# Altium schematic sheet Power.SchDoc
size A4
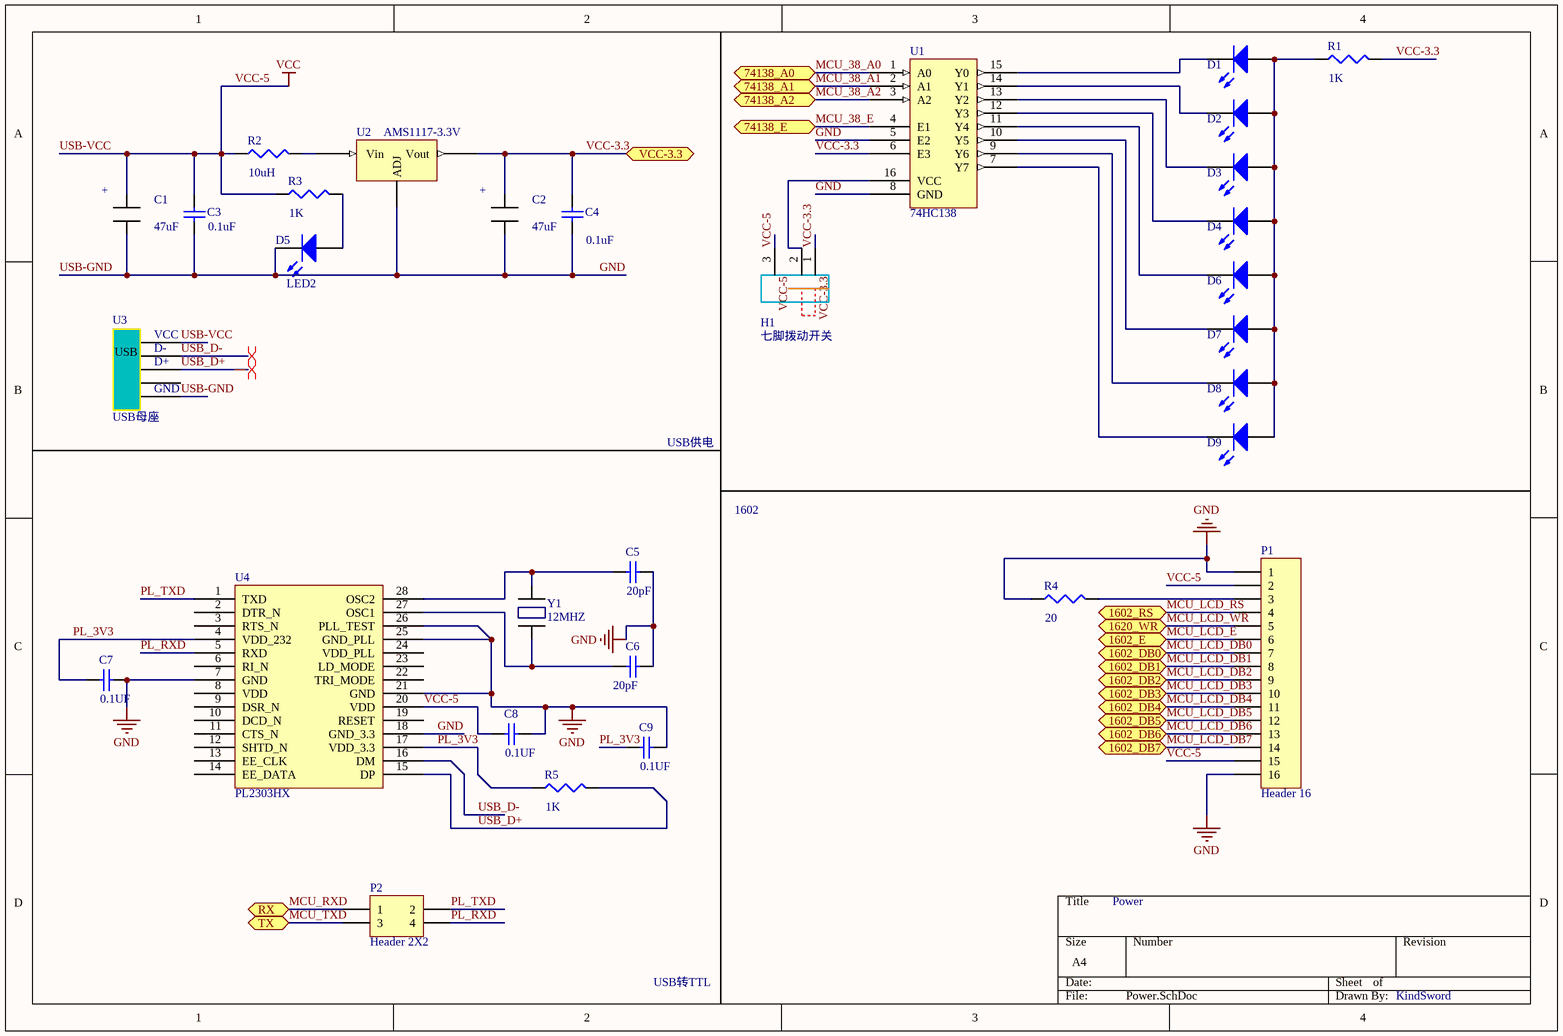
[diagram p0: Power.SchDoc]

## Parts
C1  47uF  [A型坦电容]
C2  47uF  [A型坦电容]
C3  value 0.1uF  [C1206]  (hidden comment: Cap Semi)
C4  value 0.1uF  [C1206]  (hidden comment: Cap Semi)
C5  value 20pF  [C1206]  (hidden comment: Cap Semi)
C6  value 20pF  [C1206]  (hidden comment: Cap Semi)
C7  value 0.1UF  [C1206]  (hidden comment: Cap Semi)
C8  value 0.1UF  [C1206]  (hidden comment: Cap Semi)
C9  value 0.1UF  [C1206]  (hidden comment: Cap Semi)
D1  LED2  [3.2X1.6X1.1]  (value not drawn)
D2  LED2  [3.2X1.6X1.1]  (value not drawn)
D3  LED2  [3.2X1.6X1.1]  (value not drawn)
D4  LED2  [3.2X1.6X1.1]  (value not drawn)
D5  LED2  [3.2X1.6X1.1]
D6  LED1  [3.2X1.6X1.1]  (value not drawn)
D7  LED2  [3.2X1.6X1.1]  (value not drawn)
D8  LED2  [3.2X1.6X1.1]  (value not drawn)
D9  LED2  [3.2X1.6X1.1]  (value not drawn)
H1  七脚拨动开关  [七脚拨动开关]
P1  Header 16  [HDR1X16]
P2  Header 2X2  [HDR2X2]
R1  value 1K  [14-1210]  (hidden comment: Res3)
R2  value 10uH  [14-1210]  (hidden comment: Res3)
R3  value 1K  [14-1210]  (hidden comment: Res3)
R4  value 20  [14-1210]  (hidden comment: Res3)
R5  value 1K  [14-1210]  (hidden comment: Res3)
U1  74HC138  [74HC138]
U2  AMS1117-3.3V  [AMS1117]
U3  USB母座  [MicroUSB母座]
U4  PL2303HX  [PL2303HX]
Y1  12MHZ  [晶振]

## Ports
1602_DB0, 1602_DB1, 1602_DB2, 1602_DB3, 1602_DB4, 1602_DB5, 1602_DB6, 1602_DB7, 1602_E, 1602_RS, 1620_WR, 74138_A0, 74138_A1, 74138_A2, 74138_E, RX, TX, VCC-3.3

## Nets
GND: C1.1(-) C2.1(-) C3.1 C4.1 C5.2 C6.2 C7.2 C8.2 C9.2 D5.2(K) P1.1 P1.16 R4.1 U1.5(E2) U1.8(GND) U2.1(ADJ) U3.5 U4.7(GND) U4.18(GND_3.3) U4.21(GND) U4.25(GND_PLL) U4.26(PLL_TEST)  [also labelled USB-GND]
USB-VCC: C1.2(+) C3.2 C8.1 H1.3 P1.2 P1.15 R2.1 R3.1 U3.1 U4.20(VDD)  [also labelled VCC, VCC-5]
MCU_38_A0: U1.1(A0) ; port 74138_A0
MCU_38_A1: U1.2(A1) ; port 74138_A1
MCU_38_A2: U1.3(A2) ; port 74138_A2
MCU_38_E: U1.4(E1) ; port 74138_E
MCU_LCD_DB0: P1.7 ; port 1602_DB0
MCU_LCD_DB1: P1.8 ; port 1602_DB1
MCU_LCD_DB2: P1.9 ; port 1602_DB2
MCU_LCD_DB3: P1.10 ; port 1602_DB3
MCU_LCD_DB4: P1.11 ; port 1602_DB4
MCU_LCD_DB5: P1.12 ; port 1602_DB5
MCU_LCD_DB6: P1.13 ; port 1602_DB6
MCU_LCD_DB7: P1.14 ; port 1602_DB7
MCU_LCD_E: P1.6 ; port 1602_E
MCU_LCD_RS: P1.4 ; port 1602_RS
MCU_LCD_WR: P1.5 ; port 1620_WR
MCU_RXD: P2.1 ; port RX
MCU_TXD: P2.3 ; port TX
PL_3V3: C7.1 C9.1 R5.1 U4.4(VDD_232) U4.17(VDD_3.3)
PL_RXD: P2.4 U4.5(RXD)
PL_TXD: P2.2 U4.1(TXD)
USB_D+: R5.2 U3.3 U4.15(DP)
USB_D-: U3.2 U4.16(DM)
VCC-3.3: C2.2(+) C4.2 H1.1 R1.2 U1.6(E3) U2.2(Vout) ; port VCC-3.3
NetC5_1: C5.1 U4.28(OSC2) Y1.2
NetC6_1: C6.1 U4.27(OSC1) Y1.1
NetD1_1: D1.1(A) D2.1(A) D3.1(A) D4.1(A) D6.1(A) D7.1(A) D8.1(A) D9.1(A) R1.1
NetD1_2: D1.2(K) U1.15(Y0)
NetD2_2: D2.2(K) U1.14(Y1)
NetD3_2: D3.2(K) U1.13(Y2)
NetD4_2: D4.2(K) U1.12(Y3)
NetD5_1: D5.1(A) R3.2
NetD6_2: D6.2(K) U1.11(Y4)
NetD7_2: D7.2(K) U1.10(Y5)
NetD8_2: D8.2(K) U1.9(Y6)
NetD9_2: D9.2(K) U1.7(Y7)
NetH1_2: H1.2 U1.16(VCC)
NetP1_3: P1.3 R4.2
NetR2_2: R2.2 U2.3(Vin)

Not connected (* = marked no-connect by the designer): U3 4; U4 2(DTR_N) 3(RTS_N) 6(RI_N) 8(VDD) 9(DSR_N) 10(DCD_N) 11(CTS_N) 12(SHTD_N) 13(EE_CLK) 14(EE_DATA) 19(RESET) 22(TRI_MODE) 23(LD_MODE) 24(VDD_PLL)

## Layout directives
differential pair: USB_D+, USB_D-

## Notes on the sheet
- USB供电
- 1602
- Power
- USB转TTL
- KindSword
- Labels drawn without touching a wire or pin: VCC-3.3, VCC-5
- (in symbol MicroUSB母座) VCC; D-; D+; GND; / USB /

## Library data of the parts
C1 C2 = A型坦电容: pin to pad: 1>0 2>1
C3-C9 = Cap Semi: Capacitor (Semiconductor SIM Model); Published: 8-Jun-2000; LatestRevisionDate: 29-May-2009; LatestRevisionNote: IPC-7351 Footprint Added.; PackageReference: C1206; Publisher: Altium Limited; PackageDescription: Chip Capacitor
D1-D9 = LED2: Typical RED, GREEN, YELLOW, AMBER GaAs LED; Published: 8-Jun-2000; LatestRevisionDate: 17-Jul-2002; LatestRevisionNote: Re-released for DXP Platform.; PackageVersion: Feb-2002; PackageReference: 3.2X1.6X1.1; Publisher: Altium Limited; PackageDescription: SM LED; 2 Flat Leads
H1 = 七脚拨动开关: H?
P1 = Header 16: Header, 16-Pin; LatestRevisionDate: 17-Jul-2002; LatestRevisionNote: Re-released for DXP Platform.; Publisher: Altium Limited
P2 = Header 2X2: Header, 2-Pin, Dual row; LatestRevisionDate: 17-Jul-2002; LatestRevisionNote: Re-released for DXP Platform.; Publisher: Altium Limited
R1-R5 = Res3: Resistor; Published: 8-Jun-2000; LatestRevisionDate: 29-May-2009; LatestRevisionNote: IPC-7351 Footprint Added.; PackageReference: J1-0603; Publisher: Altium Limited; PackageDescription: Chip Resistor
U2 = AMS1117
U3 = MicroUSB母座: U?
Y1 = 晶振: Y?